# Altium schematic sheet Commutation.SchDoc
size A3; SheetNumber: 5; SheetTotal: 11
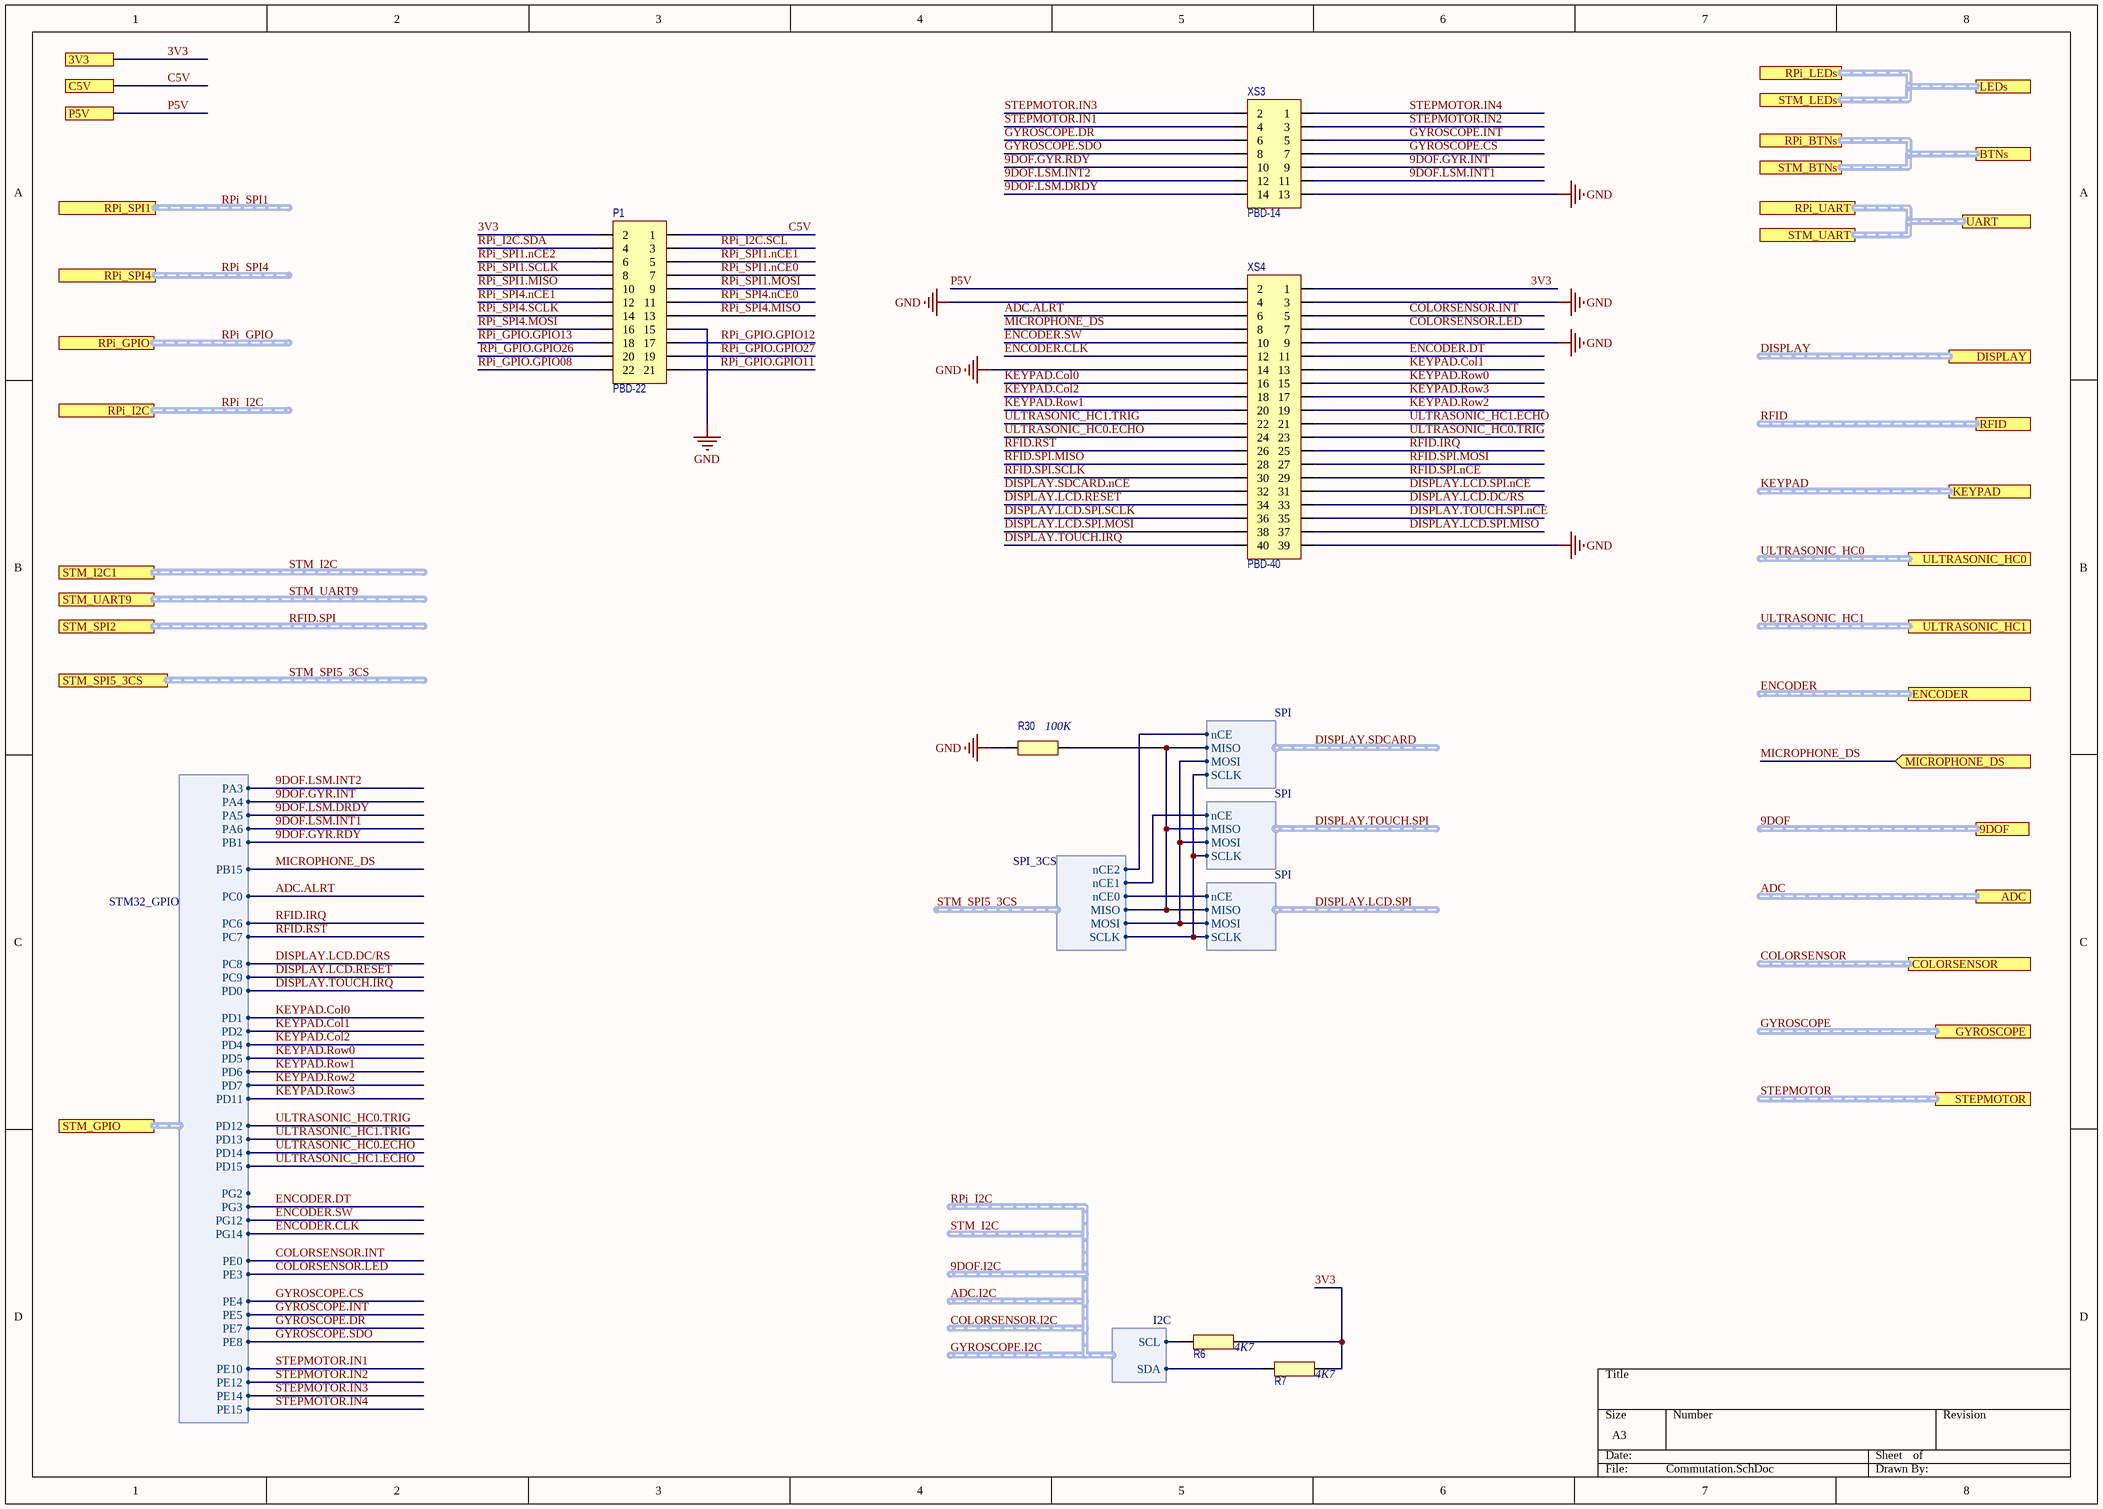
[diagram p0: Commutation.SchDoc]

## Parts
P1  PBD-22  [PBD-22]
R6  value 4K7  [R0805]  (hidden comment: R0805)
R7  value 4K7  [R0805]  (hidden comment: R0805)
R30  value 100K  [R0805]  (hidden comment: R0805)
XS3  PBD-14  [PBD-14]
XS4  PBD-40  [PBD-40]

## Ports
3V3, 9DOF (harness 9DOF), ADC (harness ADS1115 module), BTNs (harness BUTTONS), C5V, COLORSENSOR (harness TCS34725), DISPLAY (harness MSP3520), ENCODER (harness KY-040), GYROSCOPE (harness GY-50 L3GD20 Gyro), KEYPAD (harness Keypad COM-08653), LEDs (harness LEDS), MICROPHONE_DS (in), P5V, RFID (harness RC522), RPi_BTNs (harness BUTTONS), RPi_GPIO (harness RPi_GPIO), RPi_I2C (harness I2C), RPi_LEDs (harness LEDS), RPi_SPI1 (harness SPI_3CS), RPi_SPI4 (harness SPI_2CS), RPi_UART (harness UART), STEPMOTOR (harness ULN2003 Module), STM_BTNs (harness BUTTONS), STM_GPIO (harness STM32_GPIO), STM_I2C1 (harness I2C), STM_LEDs (harness LEDS), STM_SPI2 (harness SPI), STM_SPI5_3CS (harness SPI_3CS), STM_UART9 (harness UART), STM_UART (harness UART), UART (harness UART), ULTRASONIC_HC0 (harness HC-SR04), ULTRASONIC_HC1 (harness HC-SR04)

## Harnesses
I2C: SCL, SDA
SPI: nCE, MISO, MOSI, SCLK
STM32_GPIO: PB1, PB15, PC0, PC6, PC7, PC8, PC9, PD0, PD1, PD2, PD4, PD5, PD6, PD11, PD12, PD13, PD14, PD15, PG2, PG3, PG12, PG14, PE0, PE3, PE4, PE5, PE7, PE8, PE10, PE12, PE14, PE15, PD7, PA6, PA3, PA4, PA5
SPI_3CS: nCE2, nCE1, nCE0, MISO, MOSI, SCLK

## Nets
GND: P1.15 R30.1 XS3.13 XS4.3 XS4.4 XS4.9 XS4.14 XS4.39
3V3: P1.2 R6.1 R7.1 XS4.1 ; port 3V3
9DOF.GYR.INT: XS3.9 ; port STM_GPIO.PA4
9DOF.GYR.RDY: XS3.10 ; port STM_GPIO.PB1
9DOF.I2C.SCL: R6.2 ; port RPi_I2C.SCL
9DOF.I2C.SDA: R7.2 ; port RPi_I2C.SDA
9DOF.LSM.DRDY: XS3.14 ; port STM_GPIO.PA5
9DOF.LSM.INT1: XS3.11 ; port STM_GPIO.PA6
9DOF.LSM.INT2: XS3.12 ; port STM_GPIO.PA3
ADC.ALRT: XS4.6 ; port STM_GPIO.PC0
C5V: P1.1 ; port C5V
COLORSENSOR.INT: XS4.5 ; port STM_GPIO.PE0
COLORSENSOR.LED: XS4.7 ; port STM_GPIO.PE3
DISPLAY.LCD.DC/RS: XS4.33 ; port STM_GPIO.PC8
DISPLAY.LCD.RESET: XS4.34 ; port STM_GPIO.PC9
DISPLAY.LCD.SPI.MISO: R30.2 ; harness SPI.MISO, port STM_SPI5_3CS.MISO
DISPLAY.LCD.SPI.MISO: XS4.37  [a separate net that carries the same name]
DISPLAY.LCD.SPI.MOSI: XS4.38
DISPLAY.LCD.SPI.MOSI: harness SPI.MOSI, port STM_SPI5_3CS.MOSI  [a separate net that carries the same name]
DISPLAY.LCD.SPI.nCE: XS4.31
DISPLAY.LCD.SPI.nCE: harness SPI.nCE, port STM_SPI5_3CS.nCE0  [a separate net that carries the same name]
DISPLAY.LCD.SPI.SCLK: XS4.36
DISPLAY.LCD.SPI.SCLK: harness SPI.SCLK, port STM_SPI5_3CS.SCLK  [a separate net that carries the same name]
DISPLAY.SDCARD.nCE: XS4.32
DISPLAY.SDCARD.nCE: harness SPI.nCE, port STM_SPI5_3CS.nCE2  [a separate net that carries the same name]
DISPLAY.TOUCH.IRQ: XS4.40 ; port STM_GPIO.PD0
DISPLAY.TOUCH.SPI.nCE: XS4.35
DISPLAY.TOUCH.SPI.nCE: harness SPI.nCE, port STM_SPI5_3CS.nCE1  [a separate net that carries the same name]
ENCODER.CLK: XS4.12 ; port STM_GPIO.PG14
ENCODER.DT: XS4.11 ; port STM_GPIO.PG3
ENCODER.SW: XS4.10 ; port STM_GPIO.PG12
GYROSCOPE.CS: XS3.7 ; port STM_GPIO.PE4
GYROSCOPE.DR: XS3.6 ; port STM_GPIO.PE7
GYROSCOPE.INT: XS3.5 ; port STM_GPIO.PE5
GYROSCOPE.SDO: XS3.8 ; port STM_GPIO.PE8
KEYPAD.Col0: XS4.16 ; port STM_GPIO.PD1
KEYPAD.Col1: XS4.13 ; port STM_GPIO.PD2
KEYPAD.Col2: XS4.18 ; port STM_GPIO.PD4
KEYPAD.Row0: XS4.15 ; port STM_GPIO.PD5
KEYPAD.Row1: XS4.20 ; port STM_GPIO.PD6
KEYPAD.Row2: XS4.19 ; port STM_GPIO.PD7
KEYPAD.Row3: XS4.17 ; port STM_GPIO.PD11
MICROPHONE_DS: XS4.8 ; port MICROPHONE_DS, port STM_GPIO.PB15
P5V: XS4.2 ; port P5V
RFID.IRQ: XS4.25 ; port STM_GPIO.PC6
RFID.RST: XS4.26 ; port STM_GPIO.PC7
RFID.SPI.MISO: XS4.28
RFID.SPI.MOSI: XS4.27
RFID.SPI.nCE: XS4.29
RFID.SPI.SCLK: XS4.30
RPi_GPIO.GPIO08: P1.22
RPi_GPIO.GPIO11: P1.21
RPi_GPIO.GPIO12: P1.17
RPi_GPIO.GPIO13: P1.18
RPi_GPIO.GPIO26: P1.20
RPi_GPIO.GPIO27: P1.19
RPi_I2C.SCL: P1.3
RPi_I2C.SDA: P1.4
RPi_SPI1.MISO: P1.10
RPi_SPI1.MOSI: P1.9
RPi_SPI1.nCE0: P1.7
RPi_SPI1.nCE1: P1.5
RPi_SPI1.nCE2: P1.6
RPi_SPI1.SCLK: P1.8
RPi_SPI4.MISO: P1.13
RPi_SPI4.MOSI: P1.16
RPi_SPI4.nCE0: P1.11
RPi_SPI4.nCE1: P1.12
RPi_SPI4.SCLK: P1.14
STEPMOTOR.IN1: XS3.4 ; port STM_GPIO.PE10
STEPMOTOR.IN2: XS3.3 ; port STM_GPIO.PE12
STEPMOTOR.IN3: XS3.2 ; port STM_GPIO.PE14
STEPMOTOR.IN4: XS3.1 ; port STM_GPIO.PE15
ULTRASONIC_HC0.ECHO: XS4.24 ; port STM_GPIO.PD14
ULTRASONIC_HC0.TRIG: XS4.23 ; port STM_GPIO.PD12
ULTRASONIC_HC1.ECHO: XS4.21 ; port STM_GPIO.PD15
ULTRASONIC_HC1.TRIG: XS4.22 ; port STM_GPIO.PD13

## Buses and harness runs
harness 9DOF = port 9DOF
harness 9DOF.I2C = ADC.I2C = COLORSENSOR.I2C = GYROSCOPE.I2C = RPi_I2C = STM_I2C
harness ADC = port ADC
harness COLORSENSOR = port COLORSENSOR
harness DISPLAY = port DISPLAY
harness ENCODER = port ENCODER
harness GYROSCOPE = port GYROSCOPE
harness KEYPAD = port KEYPAD
harness port BTNs = port RPi_BTNs = port STM_BTNs
harness port LEDs = port RPi_LEDs = port STM_LEDs
harness port RPi_UART = port STM_UART = port UART
harness RFID = port RFID
harness RFID.SPI = port STM_SPI2
harness RPi_GPIO = port RPi_GPIO
harness RPi_I2C = port RPi_I2C
harness RPi_SPI1 = port RPi_SPI1
harness RPi_SPI4 = port RPi_SPI4
harness STEPMOTOR = port STEPMOTOR
harness STM_I2C = port STM_I2C1
harness STM_SPI5_3CS = port STM_SPI5_3CS
harness STM_UART9 = port STM_UART9
harness ULTRASONIC_HC0 = port ULTRASONIC_HC0
harness ULTRASONIC_HC1 = port ULTRASONIC_HC1

## Library data of the parts
R6 R7 R30 = R0805: Case: *; Mount: *; PartNumber: *; Power: *; Tolerance: *